# Altium project miniBackplane.PrjPCB (part 2 of 2)

## Sheet Power_Supply.SchDoc
size A4
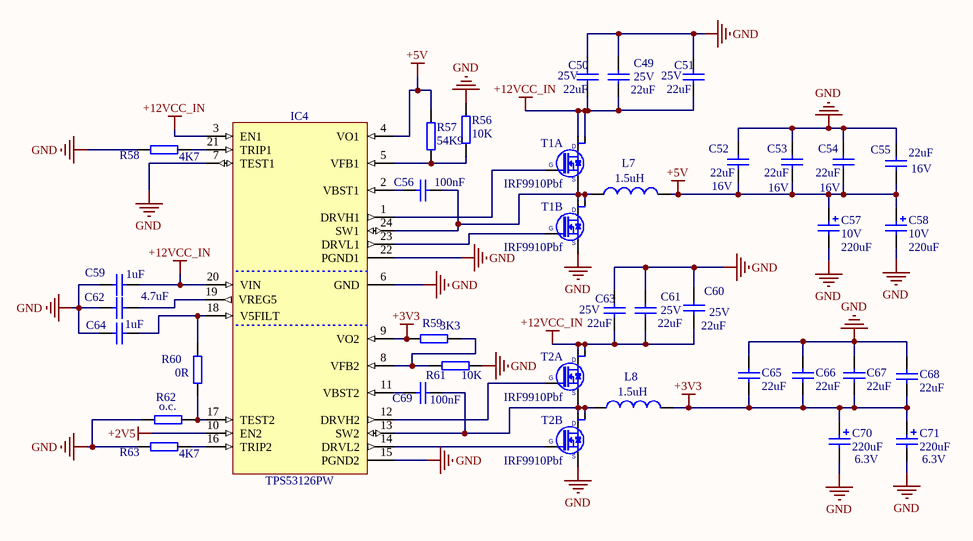
[diagram p6: Power_Supply.SchDoc]

### Parts
C49  value 22uF  Voltage: 25V  [CC3216-1206]  (hidden comment: 22uF 25V)
C50  value 22uF  Voltage: 25V  [CC3216-1206]  (hidden comment: 22uF 25V)
C51  value 22uF  Voltage: 25V  [CC3216-1206]  (hidden comment: 22uF 25V)
C52  value 22uF  Voltage: 16V  [CC2012-0805]  (hidden comment: 22uF 16V)
C53  value 22uF  Voltage: 16V  [CC2012-0805]  (hidden comment: 22uF 16V)
C54  value 22uF  Voltage: 16V  [CC2012-0805]  (hidden comment: 22uF 16V)
C55  value 22uF  Voltage: 16V  [CC2012-0805]  (hidden comment: 22uF 16V)
C56  100nF  [CC1005-0402]
C57  value 220uF  Voltage: 10V  [D]  (hidden comment: 220uF 10V)
C58  value 220uF  Voltage: 10V  [D]  (hidden comment: 220uF 10V)
C59  1uF  [CC1608-0603]
C60  value 22uF  Voltage: 25V  [CC3216-1206]  (hidden comment: 22uF 25V)
C61  value 22uF  Voltage: 25V  [CC3216-1206]  (hidden comment: 22uF 25V)
C62  4.7uF  [CC1608-0603]
C63  value 22uF  Voltage: 25V  [CC3216-1206]  (hidden comment: 22uF 25V)
C64  1uF  [CC1005-0402]
C65  22uF  [CC2012-0805]
C66  22uF  [CC2012-0805]
C67  22uF  [CC2012-0805]
C68  22uF  [CC2012-0805]
C69  100nF  [CC1005-0402]
C70  Voltage: 6.3V  [D]  (hidden comment: 220uF)
C71  Voltage: 6.3V  [D]  (hidden comment: 220uF)
IC4  TPS53126PW  [SOP65P640X120-24N]
L7  value 1.5uH  [IHLP2525]  (hidden comment: IHLP2525CZER1R5M01)
L8  value 1.5uH  [IHLP2525]  (hidden comment: IHLP2525CZER1R5M01)
R56  10K  [0402]
R57  54K9  [0603]
R58  4K7  [0402]
R59  3K3  [0603]
R60  value 0R  [0402]  (hidden comment: Jumper)
R61  10K  [0402]
R62  o.c.  [0402]
R63  4K7  [0402]
T1  IRF9910Pbf  [SOIC127P600X175-8N]  (parts A,B of 2)
T2  IRF9910Pbf  [SOIC127P600X175-8N]  (parts A,B of 2)

### Nets
+2V5: IC4.10(EN2)
+3V3: C65.2 C66.1 C67.1 C68.1 C70.1 C71.1 IC4.9(VO2) L8.2 R59.1
+5V: C52.1 C53.1 C54.1 C55.1 C57.1 C58.1 IC4.4(VO1) L7.2 R57.2
+12VCC_IN: C49.1 C50.1 C51.1 C59.2 C60.1 C61.1 C63.1 IC4.3(EN1) IC4.20(VIN) T1.5(D) T1.6(D) T2.5(D) T2.6(D)
GND: C49.2 C50.2 C51.2 C52.2 C53.2 C54.2 C55.2 C57.2 C58.2 C59.1 C60.2 C61.2 C62.2 C63.2 C64.1 C65.1 C66.2 C67.2 C68.2 C70.2 C71.2 IC4.6(GND) IC4.7(TEST1) IC4.15(PGND2) IC4.22(PGND1) R56.2 R58.2 R61.2 R62.1 R63.2 T1.1(S) T2.1(S)
NetC56_1: C56.1 IC4.2(VBST1)
NetC56_2: C56.2 IC4.24(SW1) L7.1 T1.3(S) T1.7(D) T1.8(D)
NetC62_1: C62.1 IC4.19(VREG5)
NetC64_2: C64.2 IC4.18(V5FILT) R60.1
NetC69_1: C69.1 IC4.11(VBST2)
NetC69_2: C69.2 IC4.13(SW2) L8.1 T2.3(S) T2.7(D) T2.8(D)
NetIC4_1: IC4.1(DRVH1) T1.4(G)
NetIC4_5: IC4.5(VFB1) R56.1 R57.1
NetIC4_8: IC4.8(VFB2) R59.2 R61.1
NetIC4_12: IC4.12(DRVH2) T2.4(G)
NetIC4_14: IC4.14(DRVL2) T2.2(G)
NetIC4_16: IC4.16(TRIP2) R63.1
NetIC4_17: IC4.17(TEST2) R60.2 R62.2
NetIC4_21: IC4.21(TRIP1) R58.1
NetIC4_23: IC4.23(DRVL1) T1.2(G)

### Library data of the parts
C49-C51 C60 C61 C63 = CC1206_22UF_25V_10%_X5R: Capacitor; Manufacturer1: Murata; Manufacturer1 PN: GRM31CR61E226KE15L; TC: X5R; Tolerance: ±10%; Published: 8-Jun-2000; LatestRevisionDate: 17-Jul-2002; LatestRevisionNote: Re-released for DXP Platform.; PackageReference: RAD-0.3; Publisher: Altium Limited; Distributor1: Digikey; Distributor1 PN: 490-5527-1-ND; Case: 1206
C52-C55 = CC0805_22UF_16V_10%_X5R: Capacitor; Manufacturer1: Phycomp; Manufacturer1 PN: C2012X5R1C226K; TC: X7R; Tolerance: ±10%; Published: 8-Jun-2000; LatestRevisionDate: 17-Jul-2002; LatestRevisionNote: Re-released for DXP Platform.; PackageReference: RAD-0.3; Publisher: Altium Limited; Distributor1: Digikey; Distributor1 PN: 445-6797-1-ND; Case: 0805
C56 C69 = CC0402_100NF_16V_10%_X7R: Capacitor; Manufacturer1: TDK; Manufacturer1 PN: C1005X7R1C104K; TC: X7R; Tolerance: ±10%; Voltage: 16V; Published: 8-Jun-2000; LatestRevisionDate: 17-Jul-2002; LatestRevisionNote: Re-released for DXP Platform.; PackageReference: RAD-0.3; Publisher: Altium Limited; Distributor1: Digikey; Distributor1 PN: 445-4952-1-ND; Case: 0402; Value: 100nF
C57 C58 = CP2917_220UF_10V_20%_TANT: Polarized Capacitor Tantalum; Manufacturer1: Kemet; Manufacturer1 PN: T520D227M010ATE018; Tolerance: ±20%; ESR: 18mOhm; Published: 8-Jun-2000; LatestRevisionDate: 17-Jul-2002; LatestRevisionNote: Re-released for DXP Platform.; PackageReference: RB7.6-15; Publisher: Altium Limited; Case: 2917; Distributor1: Digikey; Distributor1 PN: 399-4045-1-ND; TC: Tantalum
C59 = CC0603_1UF_25V_10%_X5R: Capacitor; Manufacturer1: Phycomp; Manufacturer1 PN: GRM188R61E105KA12D; TC: X5R; Tolerance: ±10%; Voltage: 25V; Published: 8-Jun-2000; LatestRevisionDate: 17-Jul-2002; LatestRevisionNote: Re-released for DXP Platform.; Publisher: Altium Limited; Distributor1: Digikey; Distributor1 PN: 490-3897-1-ND; Case: 0603; Value: 1uF
C62 = CC0603_4.7UF_10V_10%_X5R: Capacitor; Manufacturer1: TDK; Manufacturer1 PN: C1608X5R1A475K; TC: X5R; Tolerance: ±10%; Voltage: 10V; Published: 8-Jun-2000; LatestRevisionDate: 17-Jul-2002; LatestRevisionNote: Re-released for DXP Platform.; PackageReference: RAD-0.3; Publisher: Altium Limited; Distributor1: Digikey; Distributor1 PN: 445-5170-1-ND; Case: 0603; Value: 4.7uF
C64 = CC0402_1UF_16V_10%_X5R: Capacitor; Manufacturer1: TDK; Manufacturer1 PN: C1005X5R1C105K; TC: X5R; Tolerance: ±10%; Voltage: 16V; Published: 8-Jun-2000; LatestRevisionDate: 17-Jul-2002; LatestRevisionNote: Re-released for DXP Platform.; PackageReference: RAD-0.3; Publisher: Altium Limited; Distributor1: Digikey; Distributor1 PN: 445-4978-1-ND; Case: 0402; Value: 1uF
C65-C68 = CC0805_22UF_6.3V_20%_X5R: Capacitor; Manufacturer1: TDK; Manufacturer1 PN: C2012X5R0J226M; TC: X5R; Tolerance: ±20%; Voltage: 6.3V; Published: 8-Jun-2000; LatestRevisionDate: 17-Jul-2002; LatestRevisionNote: Re-released for DXP Platform.; PackageReference: RAD-0.3; Publisher: Altium Limited; Distributor1: Digikey; Distributor1 PN: 445-1422-1-ND; Case: 0805; Value: 22uF
C70 C71 = CP2917_220UF_6.3V_20%_TANT: Polarized Capacitor Tantalum; Manufacturer1: Kemet; Manufacturer1 PN: T520D227M006ATE009; Tolerance: ±20%; ESR: 9mOhm; Published: 8-Jun-2000; LatestRevisionDate: 17-Jul-2002; LatestRevisionNote: Re-released for DXP Platform.; PackageReference: RB7.6-15; Publisher: Altium Limited; Case: 2917; Distributor1: Digikey; Distributor1 PN: T520D227M006ATE009; TC: Tantalum; Value: 220uF
IC4 = TPS53126PW: Dual Synchronous Step-Down Controller For Low Voltage Power Rails; Manufacturer: TEXAS INSTRUMENTS; Table: Analog & Interface; Part Number: TPS53126PW; Component Kind: Standard; Component Type: Standard; Device: TPS53126PW; PackageDescription: SOP, 0.65mm Pitch; 24 Pin, 4.40mm W X 7.80mm L X 1.20mm H Body, IPC Medium Density; Part Description: Dual Synchronous Step-Down Controller For Low Voltage Power Rails; Manufacturer Part Number: TPS53126PW; Pin Count: 24; Case: QFN24; Mounted: Yes; Socket: No; SMD: Yes; ComponentHeight: 1.0mm; Author: CERN DEM JLC; HelpURL: \\cern.ch\dfs\Applications\Altium\Datasheets\TPS53126RGET.pdf; CreateDate: 2010-08-26; LatestRevisionDate: 2010-08-26; Distributor1: Digikey; Distributor1 PN: 296-24555-1-ND
L7 L8 = Inductor: Low Profile, High Current Inductor; Manufacturer: Vishay/Dale; Published: 8-Jun-2000; Revision: July-2002: Re-released for DXP Platform.; Publisher: Altium Limited; Manufacturer PN: IHLP2525CZER1R5M01; Distributor1 PN: 541-1007-1-ND; Distributor1: Digikey
R56 R61 = R0402_10K_±1%_0.1W_100PPM: SMD Resistor; Manufacturer1: Panasonic; Manufacturer1 PN: ERJ-2RKF1002X; TCR: 100ppm; Power Rating: 0.1W; Tolerance: ±1%; Case: 0402; Distributor1: DigiKey; Distributor1 PN: P10.0KLCT-ND; Value: 10K
R57 = R0603_54K9_±1%_0.1W_100PPM: SMD Resistor; Manufacturer1: Panasonic; Manufacturer1 PN: ERJ-3EKF5492V; TCR: 100ppm; Power Rating: 0.1W; Tolerance: ±1%; Case: 0603; Distributor1: DigiKey; Distributor1 PN: P54.9KHCT-ND; Value: 54K9
R58 R63 = R0402_4.7K_±1%_0.1W_100PPM: SMD Resistor; Manufacturer1: Panasonic; Manufacturer1 PN: ERJ-2RKF4701X; TCR: 100ppm; Power Rating: 0.1W; Tolerance: ±1%; Case: 0402; Distributor1: DigiKey; Distributor1 PN: ERJ-2RKF4701X; Value: 4K7
R59 = R0603_3K3_±1%_0.1W_100PPM: SMD Resistor; Manufacturer1: Yageo; Manufacturer1 PN: RC0603FR-073K3L; TCR: 100ppm; Power Rating: 0.1W; Tolerance: ±1%; Case: 0603; Distributor1: DigiKey; Distributor1 PN: 311-3.30KHRCT-ND; Value: 3K3
R60 = R0402_0R_0.1W_JUMPER: SMD Resistor; Manufacturer1: Panasonic; Manufacturer1 PN: ERJ-2GE0R00X; TCR: 100ppm; Power Rating: 0.1W; Case: 0402; Distributor1: DigiKey; Distributor1 PN: P0.0JCT-ND; Tolerance: Jumper
R62 = R0402_O.C.: SMD Resistor; Case: 0402; Manufacturer1: N/A; Manufacturer1 PN: N/A; Distributor1: N/A; Distributor1 PN: N/A; TCR: N/A; Power Rating: N/A; Tolerance: N/A; Value: o.c.
T1 T2 = IRF9910Pbf: Dual SO-8 MOSFET For POL Cconverter; Part Description: 20V 10A(Q1) 20V 12A (Q2) Dual SO-8 MOSFET For POL Cconverter; Manufacturer: INTERNATIONAL RECTIFIER; Table: Transistors; Part Number: IRF9910Pbf; Component Kind: Standard; Component Type: Standard; Device: IRF9910Pbf; PackageDescription: SOIC 8, Pitch 1.27mm - Body 4x5mm, IPC Medium Density; Manufacturer Part Number: IRF9910Pbf; Pin Count: 8; Case: DO8; Mounted: Yes; Socket: No; SMD: Yes; ComponentHeight: 1.75mm; HelpURL: \\cern.ch\dfs\Applications\Altium\Datasheets\IRF9910Pbf.pdf; Author: CERN DEM JLC; CreateDate: 30/08/2010; LatestRevisionDate: 30/08/2010

## Sheet FPGA_USB.SchDoc
size A4
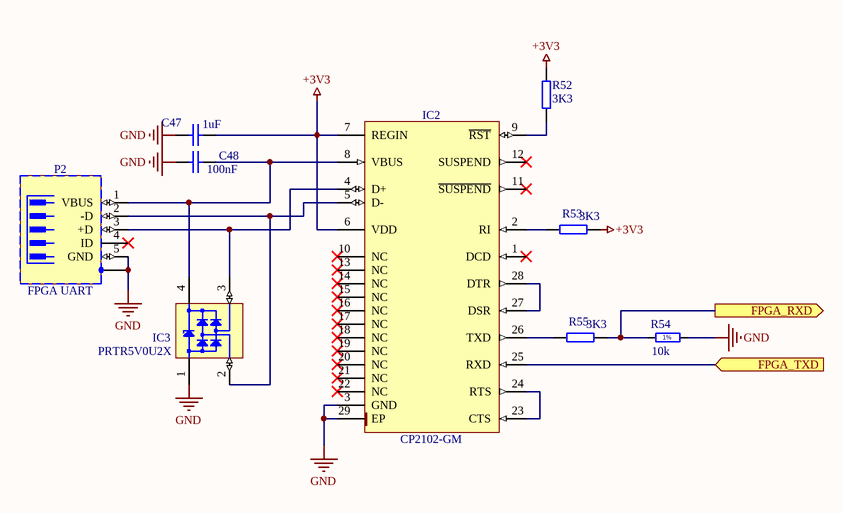
[diagram p7: FPGA_USB.SchDoc]

### Parts
C47  1uF  [CC1608-0603]
C48  100nF  [CAPC1608X87N]
IC2  CP2102-GM  [QFN50P500X500X100-29N-S335]
IC3  PRTR5V0U2X  [SOT190P230X110-4N]
P2  FPGA UART  [TYCO_1734035-1]
R52  3K3  [0603]
R53  3K3  [0603]
R54  10k  [RESC1608X55N]
R55  3K3  [0603]

### Ports
FPGA_RXD (out), FPGA_TXD (in)

### Nets
+3V3: C47.2 IC2.6(VDD) IC2.7(REGIN) R52.2 R53.2
GND: C47.1 C48.2 IC2.3(GND) IC2.29(EP) IC3.1(GND) P2.5(GND) P2.6(SH) R54.2
NetC48_1: C48.1 IC2.8(VBUS) IC3.4(VCC) P2.1(VBUS)
NetIC2_2: IC2.2(RI) R53.1
NetIC2_4: IC2.4(D+) IC3.3(I/O2) P2.3(+D)
NetIC2_5: IC2.5(D-) IC3.2(I/O1) P2.2(-D)
NetIC2_9: IC2.9(~{RST}) R52.1
NetIC2_23: IC2.23(CTS) IC2.24(RTS)
NetIC2_25: IC2.25(RXD) ; port FPGA_TXD
NetIC2_26: IC2.26(TXD) R55.1
NetIC2_27: IC2.27(DSR) IC2.28(DTR)
NetJ2_78: R54.1 R55.2 ; port FPGA_RXD

Not connected (* = marked no-connect by the designer): IC2 1(DCD)* 10(NC)* 11(~{SUSPEND})* 12(SUSPEND)* 13(NC)* 14(NC)* 15(NC)* 16(NC)* 17(NC)* 18(NC)* 19(NC)* 20(NC)* 21(NC)* 22(NC)*; P2 4(ID)*

### Notes on the sheet
- (in symbol R0603_10K_1%_0.1W_100PPM) 1%

### Library data of the parts
C47 = CC0603_1UF_25V_10%_X5R: as C59 on sheet Power_Supply; Published: 8-Jun-2000; LatestRevisionDate: 17-Jul-2002; LatestRevisionNote: Re-released for DXP Platform.; Publisher: Altium Limited; Distributor1: Digikey; Distributor1 PN: 490-3897-1-ND; Case: 0603; Value: 1uF
C48 = CC0603_100NF_50V_10%_X7R: Non-polarised capacitor; Part Description: SMD Multilayer Chip Ceramic Capacitor; Manufacturer: GENERIC; Manufacturer1 Part Number: 223858615649; Voltage: 50V; TC: X7R; Tolerance: ±10%; Table: Capacitors SMD; Part Number: CC0603_100NF_50V_10%_X7R; Component Kind: Standard; Component Type: Standard; Pin Count: 2; Value: 100nF; Status: Preferred; Manufacturer Part Number: CC0603_100NF_50V_10%_X7R; Case: 0603; Mounted: Yes; Socket: No; SMD: Yes; Manufacturer1 Example: PHYCOMP; Manufacturer1 ComponentHeight: 0.87mm; HelpURL: \\cern.ch\dfs\Applications\Altium\Datasheets\CC0603_X7R_PHYCOMP.pdf; Author: CERN DEM JLC; CreateDate: 03/12/2007; LatestRevisionDate: 03/12/2007
IC2 = CP2102-GM: Single-Chip USB to UART Bridge; Manufacturer: SILICON LABS; Table: Analog & Interface; Part Number: CP2102-GM; Component Kind: Standard; Component Type: Standard; Device: CP2102-GM; PackageDescription: QFN, 0.50mm Pitch, Square; 28 pin, 5.00mm L X 5.00mm W X 1.00mm H body (w/thermal tab 3.35 X 3.35mm),  IPC Medium Density; Part Description: Single-Chip USB to UART Bridge; Manufacturer Part Number: CP2102-GM; Pin Count: 29; Case: QFN28; Mounted: Yes; Socket: No; SMD: Yes; ComponentHeight: 1.0mm; Author: CERN DEM JLC; HelpURL: \\cern.ch\dfs\Applications\Altium\Datasheets\CP2102-GM.pdf; CreateDate: 3/3/2011; LatestRevisionDate: 3/3/2011
IC3 = PRTR5V0U2X: Ultra Low Capacitance Double Rail-to-Rail ESD Protection Diode; Part Description: Ultra Low Capacitance (1pF) Double Rail-to-Rail ESD Protection Diode (8kV); Manufacturer: PHILIPS NXP; Voltage: 5.5V; Table: Diodes; Part Number: PRTR5V0U2X; Component Kind: Standard; Component Type: Standard; Device: PRTR5V0U2X; PackageDescription: SOT143B, SOT, 1.90mm Pitch; 4 Pin, 1.30mm W X 2.90mm L X 1.10mm H body, IPC Medium Density; Manufacturer Part Number: PRTR5V0U2X; Pin Count: 4; Case: SOT143B; Mounted: Yes; Socket: No; SMD: Yes; ComponentHeight: 1.1mm; HelpURL: \\cern.ch\dfs\Applications\Altium\Datasheets\PRTR5V0U2X.pdf; Author: CERN DEM JLC; CreateDate: 3/22/2011; LatestRevisionDate: 3/22/2011
P2 = TYCO_1734035-1: 5 Pin + 1 Shield Mini USB Type B Receptacle; Part Description: 5 Position, Right Angle, SMD Mini USB Type B Receptacle; Manufacturer: TYCO ELECTRONICS; Table: TYCO; Part Number: TYCO_1734035-1; Component Kind: Standard; Component Type: Standard; Pin Count: 6; Family: USB; Mounted: Yes; Socket: No; SMD: Yes; Status: None; Manufacturer Part Number: 1734035-1; ComponentHeight: 3.95mm; HelpURL: \\cern.ch\dfs\Applications\Altium\Datasheets\TYCO_1734035-1.pdf; Author: CERN DEM JLC; CreateDate: 02/05/2011; LatestRevisionDate: 02/05/2011
R52 R53 R55 = R0603_3K3_±1%_0.1W_100PPM: as R59 on sheet Power_Supply; Case: 0603; Distributor1: DigiKey; Distributor1 PN: 311-3.30KHRCT-ND; Value: 3K3
R54 = R0603_10K_1%_0.1W_100PPM: Resistor - 1%; Part Description: General Purpose Thick Film Chip Resistor; Manufacturer: GENERIC; Manufacturer1 Part Number: NRC06F1002TRF; Power: 0.1W; TC: ±100ppm/°C; Table: Resistors SMD; Part Number: R0603_10K_1%_0.1W_100PPM; Component Kind: Standard; Component Type: Standard; Pin Count: 2; Value: 10k; Status: Preferred; Tolerance: ±1%; Manufacturer Part Number: R0603_10K_1%_0.1W_100PPM; Case: 0603; Mounted: Yes; Socket: No; SMD: Yes; Manufacturer1 Example: NIC COMPONENT; Manufacturer1 ComponentHeight: 0.55mm; HelpURL: \\cern.ch\dfs\Applications\Altium\Datasheets\R0603_NIC_NRC.pdf; Author: CERN DEM JLC; CreateDate: 12/3/2007; LatestRevisionDate: 3/13/2008

## Nets that join several sheets
+2V5: Connector_GTX (J1.81), U_WR_DWLINK0 (5 pins), U_WR_DWLINK0/U_SFP (R40_U_WR_DWLINK0_U_SFP.1), I2C_Multiplexers (R29.1 R30.1), Connectors_GPIOs (R20.1 R21.1), Power_Supply (IC4.10), U_WR_DWLINK1 (5 pins), U_WR_DWLINK1/U_SFP (R40_U_WR_DWLINK1_U_SFP.1), U_WR_DWLINK2 (5 pins), U_WR_DWLINK2/U_SFP (R40_U_WR_DWLINK2_U_SFP.1), U_WR_DWLINK3 (5 pins), U_WR_DWLINK3/U_SFP (R40_U_WR_DWLINK3_U_SFP.1), U_WR_DWLINK4 (5 pins), U_WR_DWLINK4/U_SFP (R40_U_WR_DWLINK4_U_SFP.1), U_WR_DWLINK5 (5 pins), U_WR_DWLINK5/U_SFP (R40_U_WR_DWLINK5_U_SFP.1), U_WR_DWLINK8 (5 pins), U_WR_DWLINK8/U_SFP (R40_U_WR_DWLINK8_U_SFP.1), U_WR_DWLINK11 (5 pins), U_WR_DWLINK11/U_SFP (R40_U_WR_DWLINK11_U_SFP.1), U_WR_DWLINK14 (5 pins), U_WR_DWLINK14/U_SFP (R40_U_WR_DWLINK14_U_SFP.1), U_WR_DWLINK17 (5 pins), U_WR_DWLINK17/U_SFP (R40_U_WR_DWLINK17_U_SFP.1), U_WR_DWLINK16 (5 pins), U_WR_DWLINK16/U_SFP (R40_U_WR_DWLINK16_U_SFP.1), U_WR_DWLINK13 (5 pins), U_WR_DWLINK13/U_SFP (R40_U_WR_DWLINK13_U_SFP.1), U_WR_DWLINK10 (5 pins), U_WR_DWLINK10/U_SFP (R40_U_WR_DWLINK10_U_SFP.1), U_WR_DWLINK7 (5 pins), U_WR_DWLINK7/U_SFP (R40_U_WR_DWLINK7_U_SFP.1), U_WR_DWLINK6 (5 pins), U_WR_DWLINK6/U_SFP (R40_U_WR_DWLINK6_U_SFP.1), U_WR_DWLINK9 (5 pins), U_WR_DWLINK9/U_SFP (R40_U_WR_DWLINK9_U_SFP.1), U_WR_DWLINK12 (5 pins), U_WR_DWLINK12/U_SFP (R40_U_WR_DWLINK12_U_SFP.1), U_WR_DWLINK15 (5 pins), U_WR_DWLINK15/U_SFP (R40_U_WR_DWLINK15_U_SFP.1)
+3V3: U_WR_DWLINK0 (C46_U_WR_DWLINK0.1 R41_U_WR_DWLINK0.2 R42_U_WR_DWLINK0.2 U7_U_WR_DWLINK0.16), U_WR_DWLINK0/U_SFP (C42_U_WR_DWLINK0_U_SFP.1 C43_U_WR_DWLINK0_U_SFP.2 L5_U_WR_DWLINK0_U_SFP.2 L6_U_WR_DWLINK0_U_SFP.2), I2C_Multiplexers (10 pins), Power_Supply (9 pins), FPGA_USB (5 pins), U_WR_DWLINK1 (5 pins), U_WR_DWLINK1/U_SFP (C42_U_WR_DWLINK1_U_SFP.1 C43_U_WR_DWLINK1_U_SFP.2 L5_U_WR_DWLINK1_U_SFP.2 L6_U_WR_DWLINK1_U_SFP.2), U_WR_DWLINK2 (5 pins), U_WR_DWLINK2/U_SFP (C42_U_WR_DWLINK2_U_SFP.1 C43_U_WR_DWLINK2_U_SFP.2 L5_U_WR_DWLINK2_U_SFP.2 L6_U_WR_DWLINK2_U_SFP.2), U_WR_DWLINK3 (6 pins), U_WR_DWLINK3/U_SFP (C42_U_WR_DWLINK3_U_SFP.1 C43_U_WR_DWLINK3_U_SFP.2 L5_U_WR_DWLINK3_U_SFP.2 L6_U_WR_DWLINK3_U_SFP.2), U_WR_DWLINK4 (5 pins), U_WR_DWLINK4/U_SFP (C42_U_WR_DWLINK4_U_SFP.1 C43_U_WR_DWLINK4_U_SFP.2 L5_U_WR_DWLINK4_U_SFP.2 L6_U_WR_DWLINK4_U_SFP.2), U_WR_DWLINK5 (6 pins), U_WR_DWLINK5/U_SFP (C42_U_WR_DWLINK5_U_SFP.1 C43_U_WR_DWLINK5_U_SFP.2 L5_U_WR_DWLINK5_U_SFP.2 L6_U_WR_DWLINK5_U_SFP.2), U_WR_DWLINK8 (C46_U_WR_DWLINK8.1 R41_U_WR_DWLINK8.2 R42_U_WR_DWLINK8.2 U7_U_WR_DWLINK8.16), U_WR_DWLINK8/U_SFP (C42_U_WR_DWLINK8_U_SFP.1 C43_U_WR_DWLINK8_U_SFP.2 L5_U_WR_DWLINK8_U_SFP.2 L6_U_WR_DWLINK8_U_SFP.2), U_WR_DWLINK11 (6 pins), U_WR_DWLINK11/U_SFP (C42_U_WR_DWLINK11_U_SFP.1 C43_U_WR_DWLINK11_U_SFP.2 L5_U_WR_DWLINK11_U_SFP.2 L6_U_WR_DWLINK11_U_SFP.2), U_WR_DWLINK14 (6 pins), U_WR_DWLINK14/U_SFP (C42_U_WR_DWLINK14_U_SFP.1 C43_U_WR_DWLINK14_U_SFP.2 L5_U_WR_DWLINK14_U_SFP.2 L6_U_WR_DWLINK14_U_SFP.2), U_WR_DWLINK17 (5 pins), U_WR_DWLINK17/U_SFP (C42_U_WR_DWLINK17_U_SFP.1 C43_U_WR_DWLINK17_U_SFP.2 L5_U_WR_DWLINK17_U_SFP.2 L6_U_WR_DWLINK17_U_SFP.2), U_WR_DWLINK16 (C46_U_WR_DWLINK16.1 R41_U_WR_DWLINK16.2 R42_U_WR_DWLINK16.2 U7_U_WR_DWLINK16.16), U_WR_DWLINK16/U_SFP (C42_U_WR_DWLINK16_U_SFP.1 C43_U_WR_DWLINK16_U_SFP.2 L5_U_WR_DWLINK16_U_SFP.2 L6_U_WR_DWLINK16_U_SFP.2), U_WR_DWLINK13 (6 pins), U_WR_DWLINK13/U_SFP (C42_U_WR_DWLINK13_U_SFP.1 C43_U_WR_DWLINK13_U_SFP.2 L5_U_WR_DWLINK13_U_SFP.2 L6_U_WR_DWLINK13_U_SFP.2), U_WR_DWLINK10 (5 pins), U_WR_DWLINK10/U_SFP (C42_U_WR_DWLINK10_U_SFP.1 C43_U_WR_DWLINK10_U_SFP.2 L5_U_WR_DWLINK10_U_SFP.2 L6_U_WR_DWLINK10_U_SFP.2), U_WR_DWLINK7 (7 pins), U_WR_DWLINK7/U_SFP (C42_U_WR_DWLINK7_U_SFP.1 C43_U_WR_DWLINK7_U_SFP.2 L5_U_WR_DWLINK7_U_SFP.2 L6_U_WR_DWLINK7_U_SFP.2), U_WR_DWLINK6 (6 pins), U_WR_DWLINK6/U_SFP (C42_U_WR_DWLINK6_U_SFP.1 C43_U_WR_DWLINK6_U_SFP.2 L5_U_WR_DWLINK6_U_SFP.2 L6_U_WR_DWLINK6_U_SFP.2), U_WR_DWLINK9 (5 pins), U_WR_DWLINK9/U_SFP (C42_U_WR_DWLINK9_U_SFP.1 C43_U_WR_DWLINK9_U_SFP.2 L5_U_WR_DWLINK9_U_SFP.2 L6_U_WR_DWLINK9_U_SFP.2), U_WR_DWLINK12 (5 pins), U_WR_DWLINK12/U_SFP (C42_U_WR_DWLINK12_U_SFP.1 C43_U_WR_DWLINK12_U_SFP.2 L5_U_WR_DWLINK12_U_SFP.2 L6_U_WR_DWLINK12_U_SFP.2), U_WR_DWLINK15 (7 pins), U_WR_DWLINK15/U_SFP (C42_U_WR_DWLINK15_U_SFP.1 C43_U_WR_DWLINK15_U_SFP.2 L5_U_WR_DWLINK15_U_SFP.2 L6_U_WR_DWLINK15_U_SFP.2)
+5V: Connectors_GPIOs (12 pins), Power_Supply (9 pins)
+12VCC_IN: Connectors_GPIOs (5 pins), Power_Supply (13 pins)
GND: Connector_GTX (12 pins), U_WR_DWLINK0 (9 pins), U_WR_DWLINK0/U_SFP (24 pins), I2C_Multiplexers (16 pins), Connectors_GPIOs (27 pins), Power_Supply (32 pins), FPGA_USB (8 pins), U_WR_DWLINK1 (8 pins), U_WR_DWLINK1/U_SFP (24 pins), U_WR_DWLINK2 (8 pins), U_WR_DWLINK2/U_SFP (24 pins), U_WR_DWLINK3 (7 pins), U_WR_DWLINK3/U_SFP (24 pins), U_WR_DWLINK4 (8 pins), U_WR_DWLINK4/U_SFP (24 pins), U_WR_DWLINK5 (7 pins), U_WR_DWLINK5/U_SFP (24 pins), U_WR_DWLINK8 (9 pins), U_WR_DWLINK8/U_SFP (24 pins), U_WR_DWLINK11 (7 pins), U_WR_DWLINK11/U_SFP (24 pins), U_WR_DWLINK14 (7 pins), U_WR_DWLINK14/U_SFP (24 pins), U_WR_DWLINK17 (8 pins), U_WR_DWLINK17/U_SFP (24 pins), U_WR_DWLINK16 (9 pins), U_WR_DWLINK16/U_SFP (24 pins), U_WR_DWLINK13 (7 pins), U_WR_DWLINK13/U_SFP (24 pins), U_WR_DWLINK10 (8 pins), U_WR_DWLINK10/U_SFP (24 pins), U_WR_DWLINK7 (6 pins), U_WR_DWLINK7/U_SFP (24 pins), U_WR_DWLINK6 (7 pins), U_WR_DWLINK6/U_SFP (24 pins), U_WR_DWLINK9 (8 pins), U_WR_DWLINK9/U_SFP (24 pins), U_WR_DWLINK12 (8 pins), U_WR_DWLINK12/U_SFP (24 pins), U_WR_DWLINK15 (6 pins), U_WR_DWLINK15/U_SFP (24 pins)
ARM_2V5_GPIO_PD10: Connectors_GPIOs (J2.17), U_WR_DWLINK16 (R43_U_WR_DWLINK16.1), U_WR_DWLINK16/U_SFP (CN2_U_WR_DWLINK16_U_SFP.6)
ARM_2V5_GPIO_PD11: Connectors_GPIOs (J2.19), U_WR_DWLINK17 (R43_U_WR_DWLINK17.1), U_WR_DWLINK17/U_SFP (CN2_U_WR_DWLINK17_U_SFP.6)
ARM_2V5_GPIO_PD12: I2C_Multiplexers (R24.1 U2.3 U3.3 U4.3), Connectors_GPIOs (J2.21)
ARM_2V5_GPIO_PE0: U_WR_DWLINK0 (R43_U_WR_DWLINK0.1), U_WR_DWLINK0/U_SFP (CN2_U_WR_DWLINK0_U_SFP.6), Connectors_GPIOs (J2.69)
ARM_2V5_GPIO_PE1: Connectors_GPIOs (J2.75), U_WR_DWLINK1 (R43_U_WR_DWLINK1.1), U_WR_DWLINK1/U_SFP (CN2_U_WR_DWLINK1_U_SFP.6)
ARM_2V5_GPIO_PE2: Connectors_GPIOs (J2.73), U_WR_DWLINK2 (R43_U_WR_DWLINK2.1), U_WR_DWLINK2/U_SFP (CN2_U_WR_DWLINK2_U_SFP.6)
ARM_2V5_GPIO_PE3: Connectors_GPIOs (J2.45), U_WR_DWLINK3 (R43_U_WR_DWLINK3.1), U_WR_DWLINK3/U_SFP (CN2_U_WR_DWLINK3_U_SFP.6)
ARM_2V5_GPIO_PE4: Connectors_GPIOs (J2.43), U_WR_DWLINK4 (R43_U_WR_DWLINK4.1), U_WR_DWLINK4/U_SFP (CN2_U_WR_DWLINK4_U_SFP.6)
ARM_2V5_GPIO_PE5: Connectors_GPIOs (J2.67), U_WR_DWLINK5 (R43_U_WR_DWLINK5.1), U_WR_DWLINK5/U_SFP (CN2_U_WR_DWLINK5_U_SFP.6)
ARM_2V5_GPIO_PE6: Connectors_GPIOs (J2.71), U_WR_DWLINK6 (R43_U_WR_DWLINK6.1), U_WR_DWLINK6/U_SFP (CN2_U_WR_DWLINK6_U_SFP.6)
ARM_2V5_GPIO_PE7: Connectors_GPIOs (J2.77), U_WR_DWLINK7 (R43_U_WR_DWLINK7.1), U_WR_DWLINK7/U_SFP (CN2_U_WR_DWLINK7_U_SFP.6)
ARM_2V5_GPIO_PE8: Connectors_GPIOs (J2.41), U_WR_DWLINK8 (R43_U_WR_DWLINK8.1), U_WR_DWLINK8/U_SFP (CN2_U_WR_DWLINK8_U_SFP.6)
ARM_2V5_GPIO_PE9: Connectors_GPIOs (J2.79), U_WR_DWLINK9 (R43_U_WR_DWLINK9.1), U_WR_DWLINK9/U_SFP (CN2_U_WR_DWLINK9_U_SFP.6)
ARM_2V5_GPIO_PE10: Connectors_GPIOs (J2.33), U_WR_DWLINK10 (R43_U_WR_DWLINK10.1), U_WR_DWLINK10/U_SFP (CN2_U_WR_DWLINK10_U_SFP.6)
ARM_2V5_GPIO_PE11: Connectors_GPIOs (J2.47), U_WR_DWLINK11 (R43_U_WR_DWLINK11.1), U_WR_DWLINK11/U_SFP (CN2_U_WR_DWLINK11_U_SFP.6)
ARM_2V5_GPIO_PE12: Connectors_GPIOs (J2.35), U_WR_DWLINK12 (R43_U_WR_DWLINK12.1), U_WR_DWLINK12/U_SFP (CN2_U_WR_DWLINK12_U_SFP.6)
ARM_2V5_GPIO_PE13: Connectors_GPIOs (J2.39), U_WR_DWLINK13 (R43_U_WR_DWLINK13.1), U_WR_DWLINK13/U_SFP (CN2_U_WR_DWLINK13_U_SFP.6)
ARM_2V5_GPIO_PE14: Connectors_GPIOs (J2.37), U_WR_DWLINK14 (R43_U_WR_DWLINK14.1), U_WR_DWLINK14/U_SFP (CN2_U_WR_DWLINK14_U_SFP.6)
ARM_2V5_GPIO_PE15: Connectors_GPIOs (J2.65), U_WR_DWLINK15 (R43_U_WR_DWLINK15.1), U_WR_DWLINK15/U_SFP (CN2_U_WR_DWLINK15_U_SFP.6)
ARM_3V3_GPIO_PB0: I2C_Multiplexers (R26.2 U2.23), Connectors_GPIOs (J2.57)
ARM_3V3_GPIO_PB1: I2C_Multiplexers (R25.2 U2.22), Connectors_GPIOs (J2.53)
ARM_3V3_GPIO_PB2: I2C_Multiplexers (R27.2 U3.22), Connectors_GPIOs (J2.55)
ARM_3V3_GPIO_PB3: I2C_Multiplexers (R28.2 U3.23), Connectors_GPIOs (J2.51)
ARM_3V3_GPIO_PB4: Connectors_GPIOs (J2.59), U_WR_DWLINK17 (R42_U_WR_DWLINK17.1), U_WR_DWLINK17/U_SFP (CN2_U_WR_DWLINK17_U_SFP.4), U_WR_DWLINK16 (R42_U_WR_DWLINK16.1), U_WR_DWLINK16/U_SFP (CN2_U_WR_DWLINK16_U_SFP.4)
ARM_3V3_GPIO_PB5: Connectors_GPIOs (J2.61), U_WR_DWLINK17 (R41_U_WR_DWLINK17.1), U_WR_DWLINK17/U_SFP (CN2_U_WR_DWLINK17_U_SFP.5), U_WR_DWLINK16 (R41_U_WR_DWLINK16.1), U_WR_DWLINK16/U_SFP (CN2_U_WR_DWLINK16_U_SFP.5)
FPGA_GPIO0: U_WR_DWLINK0 (R46_U_WR_DWLINK0.2), Connectors_GPIOs (J2.2)
FPGA_GPIO1: U_WR_DWLINK0 (R44_U_WR_DWLINK0.1), Connectors_GPIOs (J2.4)
FPGA_GPIO2: Connectors_GPIOs (J2.6), U_WR_DWLINK1 (R46_U_WR_DWLINK1.2)
FPGA_GPIO3: Connectors_GPIOs (J2.8), U_WR_DWLINK1 (R44_U_WR_DWLINK1.1)
FPGA_GPIO4: Connectors_GPIOs (J2.10), U_WR_DWLINK2 (R46_U_WR_DWLINK2.2)
FPGA_GPIO5: Connectors_GPIOs (J2.12), U_WR_DWLINK2 (R44_U_WR_DWLINK2.1)
FPGA_GPIO6: Connectors_GPIOs (J2.14), U_WR_DWLINK3 (R46_U_WR_DWLINK3.2)
FPGA_GPIO7: Connectors_GPIOs (J2.16), U_WR_DWLINK3 (R44_U_WR_DWLINK3.1)
FPGA_GPIO8: Connectors_GPIOs (J2.18), U_WR_DWLINK4 (R46_U_WR_DWLINK4.2)
FPGA_GPIO9: Connectors_GPIOs (J2.20), U_WR_DWLINK4 (R44_U_WR_DWLINK4.1)
FPGA_GPIO10: Connectors_GPIOs (J2.22), U_WR_DWLINK5 (R46_U_WR_DWLINK5.2)
FPGA_GPIO11: Connectors_GPIOs (J2.24), U_WR_DWLINK5 (R44_U_WR_DWLINK5.1)
FPGA_GPIO12: Connectors_GPIOs (J2.26), U_WR_DWLINK6 (R46_U_WR_DWLINK6.2)
FPGA_GPIO13: Connectors_GPIOs (J2.28), U_WR_DWLINK6 (R44_U_WR_DWLINK6.1)
FPGA_GPIO14: Connectors_GPIOs (J2.30), U_WR_DWLINK7 (R46_U_WR_DWLINK7.2)
FPGA_GPIO15: Connectors_GPIOs (J2.32), U_WR_DWLINK7 (R44_U_WR_DWLINK7.1)
FPGA_GPIO16: Connectors_GPIOs (J2.34), U_WR_DWLINK8 (R46_U_WR_DWLINK8.2)
FPGA_GPIO17: Connectors_GPIOs (J2.36), U_WR_DWLINK8 (R44_U_WR_DWLINK8.1)
FPGA_GPIO18: Connectors_GPIOs (J2.38), U_WR_DWLINK9 (R46_U_WR_DWLINK9.2)
FPGA_GPIO19: Connectors_GPIOs (J2.40), U_WR_DWLINK9 (R44_U_WR_DWLINK9.1)
FPGA_GPIO20: Connectors_GPIOs (J2.42), U_WR_DWLINK10 (R46_U_WR_DWLINK10.2)
FPGA_GPIO21: Connectors_GPIOs (J2.44), U_WR_DWLINK10 (R44_U_WR_DWLINK10.1)
FPGA_GPIO22: Connectors_GPIOs (J2.46), U_WR_DWLINK11 (R46_U_WR_DWLINK11.2)
FPGA_GPIO23: Connectors_GPIOs (J2.48), U_WR_DWLINK11 (R44_U_WR_DWLINK11.1)
FPGA_GPIO24: Connectors_GPIOs (J2.50), U_WR_DWLINK12 (R46_U_WR_DWLINK12.2)
FPGA_GPIO25: Connectors_GPIOs (J2.52), U_WR_DWLINK12 (R44_U_WR_DWLINK12.1)
FPGA_GPIO26: Connectors_GPIOs (J2.54), U_WR_DWLINK13 (R46_U_WR_DWLINK13.2)
FPGA_GPIO27: Connectors_GPIOs (J2.56), U_WR_DWLINK13 (R44_U_WR_DWLINK13.1)
FPGA_GPIO28: Connectors_GPIOs (J2.58), U_WR_DWLINK14 (R46_U_WR_DWLINK14.2)
FPGA_GPIO29: Connectors_GPIOs (J2.60), U_WR_DWLINK14 (R44_U_WR_DWLINK14.1)
FPGA_GPIO30: Connectors_GPIOs (J2.62), U_WR_DWLINK15 (R46_U_WR_DWLINK15.2)
FPGA_GPIO31: Connectors_GPIOs (J2.64), U_WR_DWLINK15 (R44_U_WR_DWLINK15.1)
FPGA_GPIO32: Connectors_GPIOs (J2.66), U_WR_DWLINK16 (R46_U_WR_DWLINK16.2)
FPGA_GPIO33: Connectors_GPIOs (J2.68), U_WR_DWLINK16 (R44_U_WR_DWLINK16.1)
FPGA_GPIO34: Connectors_GPIOs (J2.70), U_WR_DWLINK17 (R46_U_WR_DWLINK17.2)
FPGA_GPIO35: Connectors_GPIOs (J2.72), U_WR_DWLINK17 (R44_U_WR_DWLINK17.1)
I2C_DL_SC0: U_WR_DWLINK0 (R41_U_WR_DWLINK0.1), U_WR_DWLINK0/U_SFP (CN2_U_WR_DWLINK0_U_SFP.5), I2C_Multiplexers (U2.5)
I2C_DL_SC1: I2C_Multiplexers (U2.7), U_WR_DWLINK1 (R41_U_WR_DWLINK1.1), U_WR_DWLINK1/U_SFP (CN2_U_WR_DWLINK1_U_SFP.5)
I2C_DL_SC2: I2C_Multiplexers (U2.9), U_WR_DWLINK2 (R41_U_WR_DWLINK2.1), U_WR_DWLINK2/U_SFP (CN2_U_WR_DWLINK2_U_SFP.5)
I2C_DL_SC3: I2C_Multiplexers (U2.11), U_WR_DWLINK3 (R41_U_WR_DWLINK3.1), U_WR_DWLINK3/U_SFP (CN2_U_WR_DWLINK3_U_SFP.5)
I2C_DL_SC4: I2C_Multiplexers (U2.14), U_WR_DWLINK4 (R41_U_WR_DWLINK4.1), U_WR_DWLINK4/U_SFP (CN2_U_WR_DWLINK4_U_SFP.5)
I2C_DL_SC5: I2C_Multiplexers (U2.16), U_WR_DWLINK5 (R41_U_WR_DWLINK5.1), U_WR_DWLINK5/U_SFP (CN2_U_WR_DWLINK5_U_SFP.5)
I2C_DL_SC6: I2C_Multiplexers (U2.18), U_WR_DWLINK6 (R41_U_WR_DWLINK6.1), U_WR_DWLINK6/U_SFP (CN2_U_WR_DWLINK6_U_SFP.5)
I2C_DL_SC7: I2C_Multiplexers (U2.20), U_WR_DWLINK7 (R41_U_WR_DWLINK7.1), U_WR_DWLINK7/U_SFP (CN2_U_WR_DWLINK7_U_SFP.5)
I2C_DL_SC8: I2C_Multiplexers (U3.5), U_WR_DWLINK8 (R41_U_WR_DWLINK8.1), U_WR_DWLINK8/U_SFP (CN2_U_WR_DWLINK8_U_SFP.5)
I2C_DL_SC9: I2C_Multiplexers (U3.7), U_WR_DWLINK9 (R41_U_WR_DWLINK9.1), U_WR_DWLINK9/U_SFP (CN2_U_WR_DWLINK9_U_SFP.5)
I2C_DL_SC10: I2C_Multiplexers (U3.9), U_WR_DWLINK10 (R41_U_WR_DWLINK10.1), U_WR_DWLINK10/U_SFP (CN2_U_WR_DWLINK10_U_SFP.5)
I2C_DL_SC11: I2C_Multiplexers (U3.11), U_WR_DWLINK11 (R41_U_WR_DWLINK11.1), U_WR_DWLINK11/U_SFP (CN2_U_WR_DWLINK11_U_SFP.5)
I2C_DL_SC12: I2C_Multiplexers (U3.14), U_WR_DWLINK12 (R41_U_WR_DWLINK12.1), U_WR_DWLINK12/U_SFP (CN2_U_WR_DWLINK12_U_SFP.5)
I2C_DL_SC13: I2C_Multiplexers (U3.16), U_WR_DWLINK13 (R41_U_WR_DWLINK13.1), U_WR_DWLINK13/U_SFP (CN2_U_WR_DWLINK13_U_SFP.5)
I2C_DL_SC14: I2C_Multiplexers (U3.18), U_WR_DWLINK14 (R41_U_WR_DWLINK14.1), U_WR_DWLINK14/U_SFP (CN2_U_WR_DWLINK14_U_SFP.5)
I2C_DL_SC15: I2C_Multiplexers (U3.20), U_WR_DWLINK15 (R41_U_WR_DWLINK15.1), U_WR_DWLINK15/U_SFP (CN2_U_WR_DWLINK15_U_SFP.5)
I2C_DL_SD0: U_WR_DWLINK0 (R42_U_WR_DWLINK0.1), U_WR_DWLINK0/U_SFP (CN2_U_WR_DWLINK0_U_SFP.4), I2C_Multiplexers (U2.4)
I2C_DL_SD1: I2C_Multiplexers (U2.6), U_WR_DWLINK1 (R42_U_WR_DWLINK1.1), U_WR_DWLINK1/U_SFP (CN2_U_WR_DWLINK1_U_SFP.4)
I2C_DL_SD2: I2C_Multiplexers (U2.8), U_WR_DWLINK2 (R42_U_WR_DWLINK2.1), U_WR_DWLINK2/U_SFP (CN2_U_WR_DWLINK2_U_SFP.4)
I2C_DL_SD3: I2C_Multiplexers (U2.10), U_WR_DWLINK3 (R42_U_WR_DWLINK3.1), U_WR_DWLINK3/U_SFP (CN2_U_WR_DWLINK3_U_SFP.4)
I2C_DL_SD4: I2C_Multiplexers (U2.13), U_WR_DWLINK4 (R42_U_WR_DWLINK4.1), U_WR_DWLINK4/U_SFP (CN2_U_WR_DWLINK4_U_SFP.4)
I2C_DL_SD5: I2C_Multiplexers (U2.15), U_WR_DWLINK5 (R42_U_WR_DWLINK5.1), U_WR_DWLINK5/U_SFP (CN2_U_WR_DWLINK5_U_SFP.4)
I2C_DL_SD6: I2C_Multiplexers (U2.17), U_WR_DWLINK6 (R42_U_WR_DWLINK6.1), U_WR_DWLINK6/U_SFP (CN2_U_WR_DWLINK6_U_SFP.4)
I2C_DL_SD7: I2C_Multiplexers (U2.19), U_WR_DWLINK7 (R42_U_WR_DWLINK7.1), U_WR_DWLINK7/U_SFP (CN2_U_WR_DWLINK7_U_SFP.4)
I2C_DL_SD8: I2C_Multiplexers (U3.4), U_WR_DWLINK8 (R42_U_WR_DWLINK8.1), U_WR_DWLINK8/U_SFP (CN2_U_WR_DWLINK8_U_SFP.4)
I2C_DL_SD9: I2C_Multiplexers (U3.6), U_WR_DWLINK9 (R42_U_WR_DWLINK9.1), U_WR_DWLINK9/U_SFP (CN2_U_WR_DWLINK9_U_SFP.4)
I2C_DL_SD10: I2C_Multiplexers (U3.8), U_WR_DWLINK10 (R42_U_WR_DWLINK10.1), U_WR_DWLINK10/U_SFP (CN2_U_WR_DWLINK10_U_SFP.4)
I2C_DL_SD11: I2C_Multiplexers (U3.10), U_WR_DWLINK11 (R42_U_WR_DWLINK11.1), U_WR_DWLINK11/U_SFP (CN2_U_WR_DWLINK11_U_SFP.4)
I2C_DL_SD12: I2C_Multiplexers (U3.13), U_WR_DWLINK12 (R42_U_WR_DWLINK12.1), U_WR_DWLINK12/U_SFP (CN2_U_WR_DWLINK12_U_SFP.4)
I2C_DL_SD13: I2C_Multiplexers (U3.15), U_WR_DWLINK13 (R42_U_WR_DWLINK13.1), U_WR_DWLINK13/U_SFP (CN2_U_WR_DWLINK13_U_SFP.4)
I2C_DL_SD14: I2C_Multiplexers (U3.17), U_WR_DWLINK14 (R42_U_WR_DWLINK14.1), U_WR_DWLINK14/U_SFP (CN2_U_WR_DWLINK14_U_SFP.4)
I2C_DL_SD15: I2C_Multiplexers (U3.19), U_WR_DWLINK15 (R42_U_WR_DWLINK15.1), U_WR_DWLINK15/U_SFP (CN2_U_WR_DWLINK15_U_SFP.4)
I2C_IO_SC0: I2C_Multiplexers (U4.5), U_WR_DWLINK17 (R49_U_WR_DWLINK17.2 U7_U_WR_DWLINK17.14), U_WR_DWLINK16 (R49_U_WR_DWLINK16.2 U7_U_WR_DWLINK16.14)
I2C_IO_SC1: U_WR_DWLINK0 (R49_U_WR_DWLINK0.2 U7_U_WR_DWLINK0.14), I2C_Multiplexers (U4.7), U_WR_DWLINK1 (R49_U_WR_DWLINK1.2 U7_U_WR_DWLINK1.14), U_WR_DWLINK2 (R49_U_WR_DWLINK2.2 U7_U_WR_DWLINK2.14), U_WR_DWLINK3 (R49_U_WR_DWLINK3.2 U7_U_WR_DWLINK3.14), U_WR_DWLINK4 (R49_U_WR_DWLINK4.2 U7_U_WR_DWLINK4.14), U_WR_DWLINK5 (R49_U_WR_DWLINK5.2 U7_U_WR_DWLINK5.14), U_WR_DWLINK7 (R49_U_WR_DWLINK7.2 U7_U_WR_DWLINK7.14), U_WR_DWLINK6 (R49_U_WR_DWLINK6.2 U7_U_WR_DWLINK6.14)
I2C_IO_SC2: I2C_Multiplexers (U4.9), U_WR_DWLINK8 (R49_U_WR_DWLINK8.2 U7_U_WR_DWLINK8.14), U_WR_DWLINK11 (R49_U_WR_DWLINK11.2 U7_U_WR_DWLINK11.14), U_WR_DWLINK14 (R49_U_WR_DWLINK14.2 U7_U_WR_DWLINK14.14), U_WR_DWLINK13 (R49_U_WR_DWLINK13.2 U7_U_WR_DWLINK13.14), U_WR_DWLINK10 (R49_U_WR_DWLINK10.2 U7_U_WR_DWLINK10.14), U_WR_DWLINK9 (R49_U_WR_DWLINK9.2 U7_U_WR_DWLINK9.14), U_WR_DWLINK12 (R49_U_WR_DWLINK12.2 U7_U_WR_DWLINK12.14), U_WR_DWLINK15 (R49_U_WR_DWLINK15.2 U7_U_WR_DWLINK15.14)
I2C_IO_SD0: I2C_Multiplexers (U4.4), U_WR_DWLINK17 (R48_U_WR_DWLINK17.1 U7_U_WR_DWLINK17.15), U_WR_DWLINK16 (R48_U_WR_DWLINK16.1 U7_U_WR_DWLINK16.15)
I2C_IO_SD1: U_WR_DWLINK0 (R48_U_WR_DWLINK0.1 U7_U_WR_DWLINK0.15), I2C_Multiplexers (U4.6), U_WR_DWLINK1 (R48_U_WR_DWLINK1.1 U7_U_WR_DWLINK1.15), U_WR_DWLINK2 (R48_U_WR_DWLINK2.1 U7_U_WR_DWLINK2.15), U_WR_DWLINK3 (R48_U_WR_DWLINK3.1 U7_U_WR_DWLINK3.15), U_WR_DWLINK4 (R48_U_WR_DWLINK4.1 U7_U_WR_DWLINK4.15), U_WR_DWLINK5 (R48_U_WR_DWLINK5.1 U7_U_WR_DWLINK5.15), U_WR_DWLINK7 (R48_U_WR_DWLINK7.1 U7_U_WR_DWLINK7.15), U_WR_DWLINK6 (R48_U_WR_DWLINK6.1 U7_U_WR_DWLINK6.15)
I2C_IO_SD2: I2C_Multiplexers (U4.8), U_WR_DWLINK8 (R48_U_WR_DWLINK8.1 U7_U_WR_DWLINK8.15), U_WR_DWLINK11 (R48_U_WR_DWLINK11.1 U7_U_WR_DWLINK11.15), U_WR_DWLINK14 (R48_U_WR_DWLINK14.1 U7_U_WR_DWLINK14.15), U_WR_DWLINK13 (R48_U_WR_DWLINK13.1 U7_U_WR_DWLINK13.15), U_WR_DWLINK10 (R48_U_WR_DWLINK10.1 U7_U_WR_DWLINK10.15), U_WR_DWLINK9 (R48_U_WR_DWLINK9.1 U7_U_WR_DWLINK9.15), U_WR_DWLINK12 (R48_U_WR_DWLINK12.1 U7_U_WR_DWLINK12.15), U_WR_DWLINK15 (R48_U_WR_DWLINK15.1 U7_U_WR_DWLINK15.15)
I2C_IOs_SCL: I2C_Multiplexers (R29.2 U4.22), Connectors_GPIOs (J2.74)
I2C_IOS_SDA: I2C_Multiplexers (R30.2 U4.23), Connectors_GPIOs (J2.76)
MGTRX112_0_N: Connector_GTX (J1.3), U_WR_DWLINK0/U_SFP (CN2_U_WR_DWLINK0_U_SFP.12)
MGTRX112_0_P: Connector_GTX (J1.1), U_WR_DWLINK0/U_SFP (CN2_U_WR_DWLINK0_U_SFP.13)
MGTRX112_1_N: Connector_GTX (J1.7), U_WR_DWLINK1/U_SFP (CN2_U_WR_DWLINK1_U_SFP.12)
MGTRX112_1_P: Connector_GTX (J1.5), U_WR_DWLINK1/U_SFP (CN2_U_WR_DWLINK1_U_SFP.13)
MGTRX112_2_N: Connector_GTX (J1.11), U_WR_DWLINK2/U_SFP (CN2_U_WR_DWLINK2_U_SFP.12)
MGTRX112_2_P: Connector_GTX (J1.9), U_WR_DWLINK2/U_SFP (CN2_U_WR_DWLINK2_U_SFP.13)
MGTRX112_3_N: Connector_GTX (J1.15), U_WR_DWLINK3/U_SFP (CN2_U_WR_DWLINK3_U_SFP.12)
MGTRX112_3_P: Connector_GTX (J1.13), U_WR_DWLINK3/U_SFP (CN2_U_WR_DWLINK3_U_SFP.13)
MGTRX113_0_N: Connector_GTX (J1.19), U_WR_DWLINK4/U_SFP (CN2_U_WR_DWLINK4_U_SFP.12)
MGTRX113_0_P: Connector_GTX (J1.17), U_WR_DWLINK4/U_SFP (CN2_U_WR_DWLINK4_U_SFP.13)
MGTRX113_1_N: Connector_GTX (J1.23), U_WR_DWLINK5/U_SFP (CN2_U_WR_DWLINK5_U_SFP.12)
MGTRX113_1_P: Connector_GTX (J1.21), U_WR_DWLINK5/U_SFP (CN2_U_WR_DWLINK5_U_SFP.13)
MGTRX113_2_N: Connector_GTX (J1.27), U_WR_DWLINK6/U_SFP (CN2_U_WR_DWLINK6_U_SFP.12)
MGTRX113_2_P: Connector_GTX (J1.25), U_WR_DWLINK6/U_SFP (CN2_U_WR_DWLINK6_U_SFP.13)
MGTRX113_3_N: Connector_GTX (J1.31), U_WR_DWLINK7/U_SFP (CN2_U_WR_DWLINK7_U_SFP.12)
MGTRX113_3_P: Connector_GTX (J1.29), U_WR_DWLINK7/U_SFP (CN2_U_WR_DWLINK7_U_SFP.13)
MGTRX114_0_N: Connector_GTX (J1.35), U_WR_DWLINK8/U_SFP (CN2_U_WR_DWLINK8_U_SFP.12)
MGTRX114_0_P: Connector_GTX (J1.33), U_WR_DWLINK8/U_SFP (CN2_U_WR_DWLINK8_U_SFP.13)
MGTRX114_1_N: Connector_GTX (J1.39), U_WR_DWLINK9/U_SFP (CN2_U_WR_DWLINK9_U_SFP.12)
MGTRX114_1_P: Connector_GTX (J1.37), U_WR_DWLINK9/U_SFP (CN2_U_WR_DWLINK9_U_SFP.13)
MGTRX114_2_N: Connector_GTX (J1.43), U_WR_DWLINK10/U_SFP (CN2_U_WR_DWLINK10_U_SFP.12)
MGTRX114_2_P: Connector_GTX (J1.41), U_WR_DWLINK10/U_SFP (CN2_U_WR_DWLINK10_U_SFP.13)
MGTRX114_3_N: Connector_GTX (J1.47), U_WR_DWLINK11/U_SFP (CN2_U_WR_DWLINK11_U_SFP.12)
MGTRX114_3_P: Connector_GTX (J1.45), U_WR_DWLINK11/U_SFP (CN2_U_WR_DWLINK11_U_SFP.13)
MGTRX115_0_N: Connector_GTX (J1.51), U_WR_DWLINK12/U_SFP (CN2_U_WR_DWLINK12_U_SFP.12)
MGTRX115_0_P: Connector_GTX (J1.49), U_WR_DWLINK12/U_SFP (CN2_U_WR_DWLINK12_U_SFP.13)
MGTRX115_1_N: Connector_GTX (J1.55), U_WR_DWLINK13/U_SFP (CN2_U_WR_DWLINK13_U_SFP.12)
MGTRX115_1_P: Connector_GTX (J1.53), U_WR_DWLINK13/U_SFP (CN2_U_WR_DWLINK13_U_SFP.13)
MGTRX115_2_N: Connector_GTX (J1.59), U_WR_DWLINK14/U_SFP (CN2_U_WR_DWLINK14_U_SFP.12)
MGTRX115_2_P: Connector_GTX (J1.57), U_WR_DWLINK14/U_SFP (CN2_U_WR_DWLINK14_U_SFP.13)
MGTRX115_3_N: Connector_GTX (J1.63), U_WR_DWLINK15/U_SFP (CN2_U_WR_DWLINK15_U_SFP.12)
MGTRX115_3_P: Connector_GTX (J1.61), U_WR_DWLINK15/U_SFP (CN2_U_WR_DWLINK15_U_SFP.13)
MGTRX116_0_N: Connector_GTX (J1.67), U_WR_DWLINK16/U_SFP (CN2_U_WR_DWLINK16_U_SFP.12)
MGTRX116_0_P: Connector_GTX (J1.65), U_WR_DWLINK16/U_SFP (CN2_U_WR_DWLINK16_U_SFP.13)
MGTRX116_1_N: Connector_GTX (J1.71), U_WR_DWLINK17/U_SFP (CN2_U_WR_DWLINK17_U_SFP.12)
MGTRX116_1_P: Connector_GTX (J1.69), U_WR_DWLINK17/U_SFP (CN2_U_WR_DWLINK17_U_SFP.13)
MGTTX112_0_N: Connector_GTX (J1.2), U_WR_DWLINK0/U_SFP (CN2_U_WR_DWLINK0_U_SFP.19)
MGTTX112_0_P: Connector_GTX (J1.4), U_WR_DWLINK0/U_SFP (CN2_U_WR_DWLINK0_U_SFP.18)
MGTTX112_1_N: Connector_GTX (J1.8), U_WR_DWLINK1/U_SFP (CN2_U_WR_DWLINK1_U_SFP.19)
MGTTX112_1_P: Connector_GTX (J1.6), U_WR_DWLINK1/U_SFP (CN2_U_WR_DWLINK1_U_SFP.18)
MGTTX112_2_N: Connector_GTX (J1.12), U_WR_DWLINK2/U_SFP (CN2_U_WR_DWLINK2_U_SFP.19)
MGTTX112_2_P: Connector_GTX (J1.10), U_WR_DWLINK2/U_SFP (CN2_U_WR_DWLINK2_U_SFP.18)
MGTTX112_3_N: Connector_GTX (J1.16), U_WR_DWLINK3/U_SFP (CN2_U_WR_DWLINK3_U_SFP.19)
MGTTX112_3_P: Connector_GTX (J1.14), U_WR_DWLINK3/U_SFP (CN2_U_WR_DWLINK3_U_SFP.18)
MGTTX113_0_N: Connector_GTX (J1.20), U_WR_DWLINK4/U_SFP (CN2_U_WR_DWLINK4_U_SFP.19)
MGTTX113_0_P: Connector_GTX (J1.18), U_WR_DWLINK4/U_SFP (CN2_U_WR_DWLINK4_U_SFP.18)
MGTTX113_1_N: Connector_GTX (J1.24), U_WR_DWLINK5/U_SFP (CN2_U_WR_DWLINK5_U_SFP.19)
MGTTX113_1_P: Connector_GTX (J1.22), U_WR_DWLINK5/U_SFP (CN2_U_WR_DWLINK5_U_SFP.18)
MGTTX113_2_N: Connector_GTX (J1.28), U_WR_DWLINK6/U_SFP (CN2_U_WR_DWLINK6_U_SFP.19)
MGTTX113_2_P: Connector_GTX (J1.26), U_WR_DWLINK6/U_SFP (CN2_U_WR_DWLINK6_U_SFP.18)
MGTTX113_3_N: Connector_GTX (J1.32), U_WR_DWLINK7/U_SFP (CN2_U_WR_DWLINK7_U_SFP.19)
MGTTX113_3_P: Connector_GTX (J1.30), U_WR_DWLINK7/U_SFP (CN2_U_WR_DWLINK7_U_SFP.18)
MGTTX114_0_N: Connector_GTX (J1.36), U_WR_DWLINK8/U_SFP (CN2_U_WR_DWLINK8_U_SFP.19)
MGTTX114_0_P: Connector_GTX (J1.34), U_WR_DWLINK8/U_SFP (CN2_U_WR_DWLINK8_U_SFP.18)
MGTTX114_1_N: Connector_GTX (J1.40), U_WR_DWLINK9/U_SFP (CN2_U_WR_DWLINK9_U_SFP.19)
MGTTX114_1_P: Connector_GTX (J1.38), U_WR_DWLINK9/U_SFP (CN2_U_WR_DWLINK9_U_SFP.18)
MGTTX114_2_N: Connector_GTX (J1.44), U_WR_DWLINK10/U_SFP (CN2_U_WR_DWLINK10_U_SFP.19)
MGTTX114_2_P: Connector_GTX (J1.42), U_WR_DWLINK10/U_SFP (CN2_U_WR_DWLINK10_U_SFP.18)
MGTTX114_3_N: Connector_GTX (J1.48), U_WR_DWLINK11/U_SFP (CN2_U_WR_DWLINK11_U_SFP.19)
MGTTX114_3_P: Connector_GTX (J1.46), U_WR_DWLINK11/U_SFP (CN2_U_WR_DWLINK11_U_SFP.18)
MGTTX115_0_N: Connector_GTX (J1.52), U_WR_DWLINK12/U_SFP (CN2_U_WR_DWLINK12_U_SFP.19)
MGTTX115_0_P: Connector_GTX (J1.50), U_WR_DWLINK12/U_SFP (CN2_U_WR_DWLINK12_U_SFP.18)
MGTTX115_1_N: Connector_GTX (J1.56), U_WR_DWLINK13/U_SFP (CN2_U_WR_DWLINK13_U_SFP.19)
MGTTX115_1_P: Connector_GTX (J1.54), U_WR_DWLINK13/U_SFP (CN2_U_WR_DWLINK13_U_SFP.18)
MGTTX115_2_N: Connector_GTX (J1.60), U_WR_DWLINK14/U_SFP (CN2_U_WR_DWLINK14_U_SFP.19)
MGTTX115_2_P: Connector_GTX (J1.58), U_WR_DWLINK14/U_SFP (CN2_U_WR_DWLINK14_U_SFP.18)
MGTTX115_3_N: Connector_GTX (J1.64), U_WR_DWLINK15/U_SFP (CN2_U_WR_DWLINK15_U_SFP.19)
MGTTX115_3_P: Connector_GTX (J1.62), U_WR_DWLINK15/U_SFP (CN2_U_WR_DWLINK15_U_SFP.18)
MGTTX116_0_N: Connector_GTX (J1.68), U_WR_DWLINK16/U_SFP (CN2_U_WR_DWLINK16_U_SFP.19)
MGTTX116_0_P: Connector_GTX (J1.66), U_WR_DWLINK16/U_SFP (CN2_U_WR_DWLINK16_U_SFP.18)
MGTTX116_1_N: Connector_GTX (J1.72), U_WR_DWLINK17/U_SFP (CN2_U_WR_DWLINK17_U_SFP.19)
MGTTX116_1_P: Connector_GTX (J1.70), U_WR_DWLINK17/U_SFP (CN2_U_WR_DWLINK17_U_SFP.18)
NetIC2_25: Connectors_GPIOs (J2.80), FPGA_USB (IC2.25)
NetJ2_78: Connectors_GPIOs (J2.78), FPGA_USB (R54.1 R55.2)
SFP_TX_DISABLE: U_WR_DWLINK0 (U7_U_WR_DWLINK0.9), U_WR_DWLINK0/U_SFP (CN2_U_WR_DWLINK0_U_SFP.3)
SFP_TX_DISABLE: U_WR_DWLINK1 (U7_U_WR_DWLINK1.9), U_WR_DWLINK1/U_SFP (CN2_U_WR_DWLINK1_U_SFP.3)
SFP_TX_DISABLE: U_WR_DWLINK2 (U7_U_WR_DWLINK2.9), U_WR_DWLINK2/U_SFP (CN2_U_WR_DWLINK2_U_SFP.3)
SFP_TX_DISABLE: U_WR_DWLINK3 (U7_U_WR_DWLINK3.9), U_WR_DWLINK3/U_SFP (CN2_U_WR_DWLINK3_U_SFP.3)
SFP_TX_DISABLE: U_WR_DWLINK4 (U7_U_WR_DWLINK4.9), U_WR_DWLINK4/U_SFP (CN2_U_WR_DWLINK4_U_SFP.3)
SFP_TX_DISABLE: U_WR_DWLINK5 (U7_U_WR_DWLINK5.9), U_WR_DWLINK5/U_SFP (CN2_U_WR_DWLINK5_U_SFP.3)
SFP_TX_DISABLE: U_WR_DWLINK8 (U7_U_WR_DWLINK8.9), U_WR_DWLINK8/U_SFP (CN2_U_WR_DWLINK8_U_SFP.3)
SFP_TX_DISABLE: U_WR_DWLINK11 (U7_U_WR_DWLINK11.9), U_WR_DWLINK11/U_SFP (CN2_U_WR_DWLINK11_U_SFP.3)
SFP_TX_DISABLE: U_WR_DWLINK14 (U7_U_WR_DWLINK14.9), U_WR_DWLINK14/U_SFP (CN2_U_WR_DWLINK14_U_SFP.3)
SFP_TX_DISABLE: U_WR_DWLINK17 (U7_U_WR_DWLINK17.9), U_WR_DWLINK17/U_SFP (CN2_U_WR_DWLINK17_U_SFP.3)
SFP_TX_DISABLE: U_WR_DWLINK16 (U7_U_WR_DWLINK16.9), U_WR_DWLINK16/U_SFP (CN2_U_WR_DWLINK16_U_SFP.3)
SFP_TX_DISABLE: U_WR_DWLINK13 (U7_U_WR_DWLINK13.9), U_WR_DWLINK13/U_SFP (CN2_U_WR_DWLINK13_U_SFP.3)
SFP_TX_DISABLE: U_WR_DWLINK10 (U7_U_WR_DWLINK10.9), U_WR_DWLINK10/U_SFP (CN2_U_WR_DWLINK10_U_SFP.3)
SFP_TX_DISABLE: U_WR_DWLINK7 (U7_U_WR_DWLINK7.9), U_WR_DWLINK7/U_SFP (CN2_U_WR_DWLINK7_U_SFP.3)
SFP_TX_DISABLE: U_WR_DWLINK6 (U7_U_WR_DWLINK6.9), U_WR_DWLINK6/U_SFP (CN2_U_WR_DWLINK6_U_SFP.3)
SFP_TX_DISABLE: U_WR_DWLINK9 (U7_U_WR_DWLINK9.9), U_WR_DWLINK9/U_SFP (CN2_U_WR_DWLINK9_U_SFP.3)
SFP_TX_DISABLE: U_WR_DWLINK12 (U7_U_WR_DWLINK12.9), U_WR_DWLINK12/U_SFP (CN2_U_WR_DWLINK12_U_SFP.3)
SFP_TX_DISABLE: U_WR_DWLINK15 (U7_U_WR_DWLINK15.9), U_WR_DWLINK15/U_SFP (CN2_U_WR_DWLINK15_U_SFP.3)